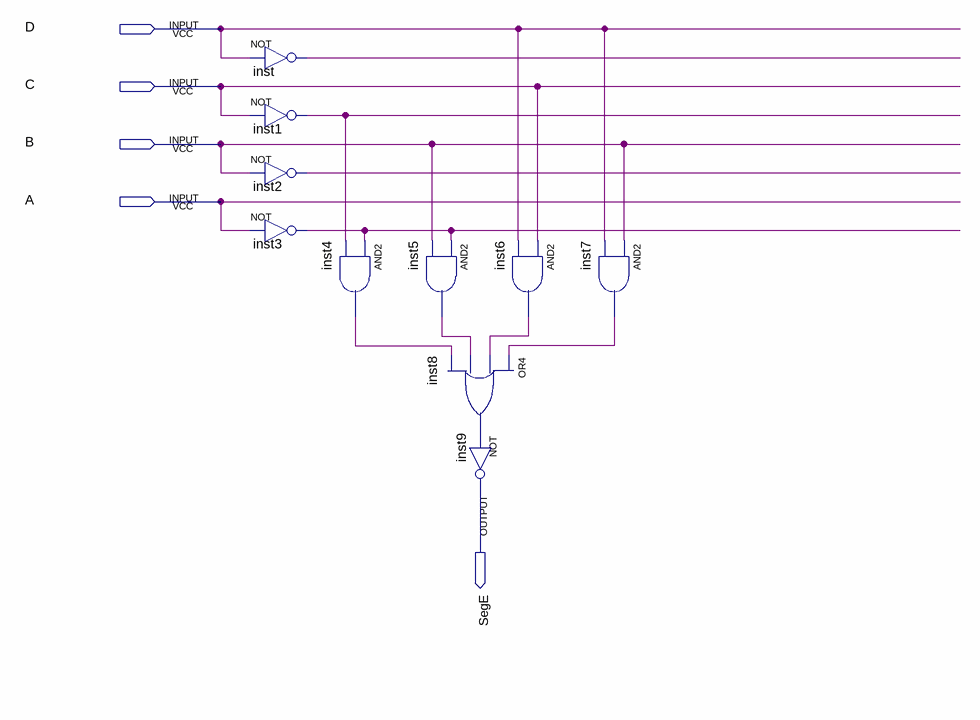
[diagram p0: schematic sheet]
// Quartus schematic SegE.bdf as structural Verilog: 10 symbols, 5 pins
module SegE (
  input  D,
  input  C,
  input  B,
  input  A,
  output SegE
);

  wire inst1_out, inst2_out, inst3_out, inst4_out, inst5_out, inst6_out, inst7_out, inst8_out, inst_out;

  not inst (inst_out, D);
  not inst1 (inst1_out, C);
  not inst2 (inst2_out, B);
  not inst3 (inst3_out, A);
  and inst4 (inst4_out, inst3_out, inst1_out);
  and inst5 (inst5_out, inst3_out, B);
  or inst8 (inst8_out, inst7_out, inst6_out, inst5_out, inst4_out);
  and inst6 (inst6_out, C, D);
  not inst9 (SegE, inst8_out);
  and inst7 (inst7_out, B, D);
endmodule
